# EAGLE design CubeSatBoard1 (EAGLE 8.4.1)
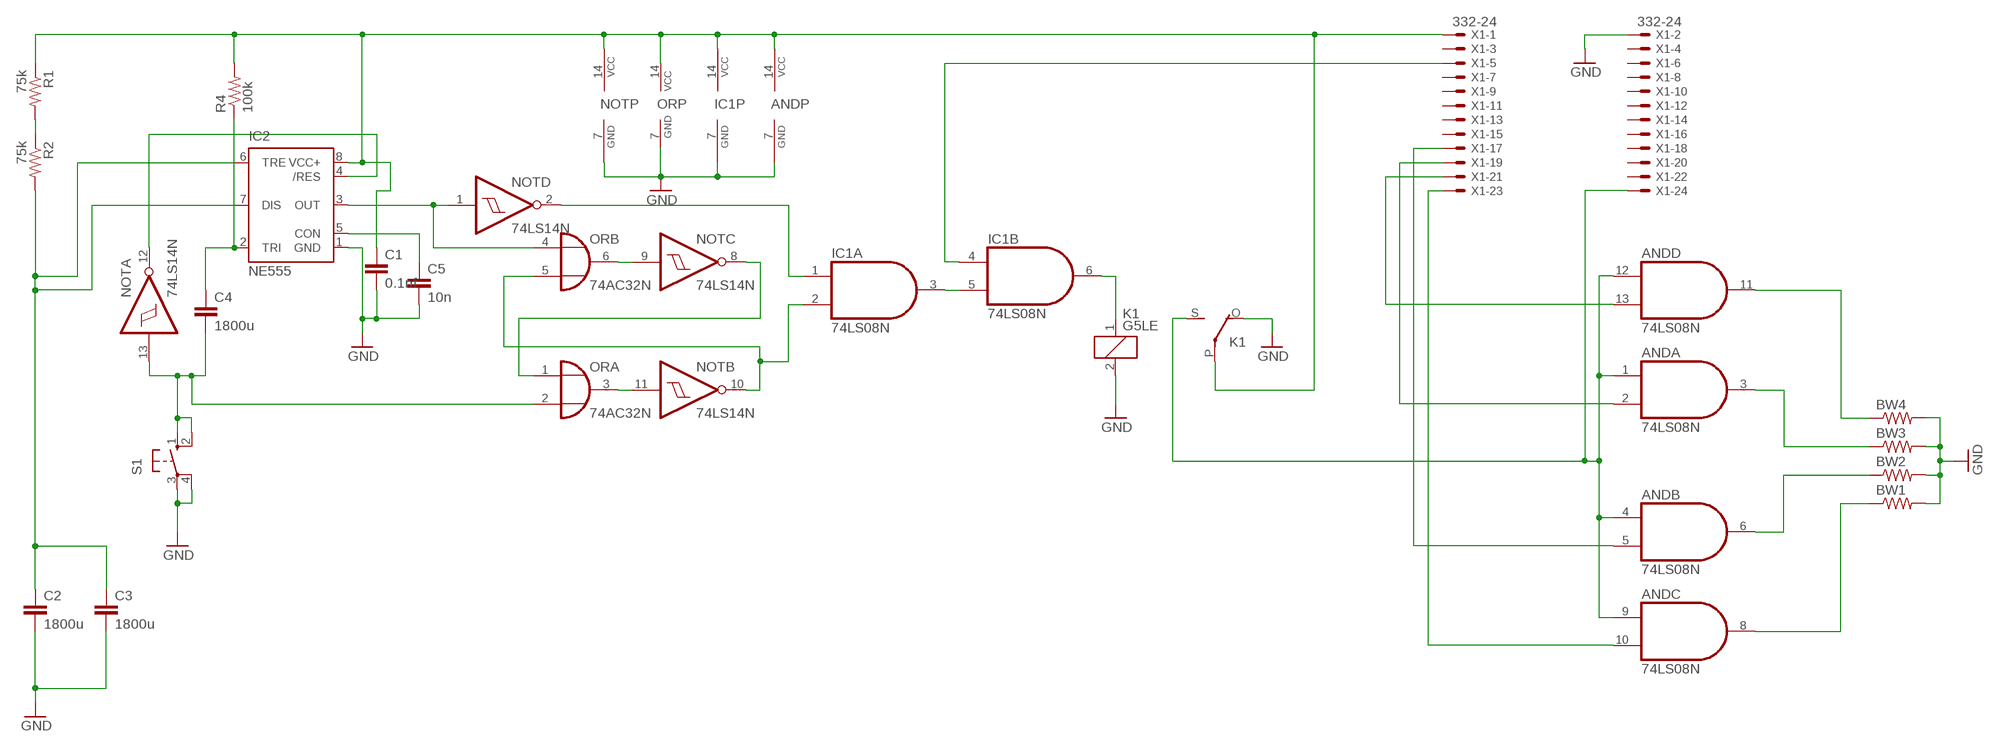
[diagram p0: schematic, sheet 1]

## Parts
AND  74LS08N  [DIL14]
BW1  R-US_0309/10  [0309/10]
BW2  R-US_0309/10  [0309/10]
BW3  R-US_0309/10  [0309/10]
BW4  R-US_0309/10  [0309/10]
C1  0.1nf  C5/3  [C5B3]
C2  1800u  C5/3  [C5B3]
C3  1800u  C5/3  [C5B3]
C4  1800u  C5/3  [C5B3]
C5  10n  C5/3  [C5B3]
IC1  74LS08N  [DIL14]
IC2  NE555  [DIL-08]
K1  G5LE  [G5LE]
NOT  74LS14N  [DIL14]
OR  74AC32N  [DIL14]
R1  75k  R-US_0309/10  [0309/10]
R2  75k  R-US_0309/10  [0309/10]
R4  100k  R-US_0309/10  [0309/10]
S1  10-XX  [B3F-10XX]
X1  332-24  [332-24]

## Nets
GND: AND.7(P:GND) BW1.2 BW2.2 BW3.2 BW4.2 C1.2 C2.2 C3.2 C5.2 IC1.7(P:GND) IC2.1(GND) K1.2 K1.O(2:O) NOT.7(P:GND) OR.7(P:GND) S1.3(P) S1.4(P1) X1.2
N$1: R1.2 R2.1
N$2: C2.1 C3.1 IC2.6(TRE) IC2.7(DIS) R2.2
N$3: AND.14(P:VCC) C1.1 IC1.14(P:VCC) IC2.8(VCC+) K1.P(2:P) NOT.14(P:VCC) OR.14(P:VCC) R1.1 R4.2 X1.1
N$4: NOT.9(C:I) OR.6(B:O)
N$5: IC2.4(/RES) NOT.12(A:O)
N$6: NOT.11(B:I) OR.3(A:O)
N$7: C4.2 NOT.13(A:I) OR.2(A:I1) S1.1(S) S1.2(S1)
N$8: C4.1 IC2.2(TRI) R4.1
N$9: IC2.3(OUT) NOT.1(D:I) OR.4(B:I0)
N$10: C5.1 IC2.5(CON)
N$11: AND.13(D:I1) X1.21
N$12: NOT.8(C:O) OR.1(A:I0)
N$13: IC1.2(A:I1) NOT.10(B:O) OR.5(B:I1)
N$14: IC1.1(A:I0) NOT.2(D:O)
N$15: IC1.3(A:O) IC1.5(B:I1)
N$16: AND.6(B:O) BW2.1
N$17: IC1.6(B:O) K1.1
N$18: AND.11(D:O) BW4.1
N$19: AND.3(A:O) BW3.1
N$20: AND.8(C:O) BW1.1
N$21: AND.1(A:I0) AND.4(B:I0) AND.9(C:I0) AND.12(D:I0) K1.S(2:S) X1.24
N$26: IC1.4(B:I0) X1.5
N$27: AND.2(A:I1) X1.19
N$28: AND.5(B:I1) X1.17
N$29: AND.10(C:I1) X1.23
Unconnected: IC1.8(C:O) IC1.9(C:I0) IC1.10(C:I1) IC1.11(D:O) IC1.12(D:I0) IC1.13(D:I1) NOT.3(E:I) NOT.4(E:O) NOT.5(F:I) NOT.6(F:O) OR.8(C:O) OR.9(C:I0) OR.10(C:I1) OR.11(D:O) OR.12(D:I0) OR.13(D:I1) X1.3 X1.4 X1.6 X1.7 X1.8 X1.9 X1.10 X1.11 X1.12 X1.13 X1.14 X1.15 X1.16 X1.18 X1.20 X1.22

## Library data of the parts
AND IC1 = 74xx-us:74*08: Quad 2-input AND gate
BW1-BW4 R1 R2 R4 = ECE2240+Project:R-US_: RESISTOR, American symbol
C1-C5 = ECE2240+Project:C: CAPACITOR naming: grid - package width
IC2 = st-microelectronics:NE555: General purpose bipolar Timer; MF: Arrow Electronics; MPN: NE555N; OC_FARNELL: 1467742; OC_NEWARK: 89K1486
K1 = relay:G5LE: RELAY 1 x switch, 10 A/120 V AC, 8 A/30 V DC, Omron; OC_FARNELL: unknown; OC_NEWARK: unknown
NOT = 74xx-us:74*14: Hex schmitt trigger INVERTER
OR = 74xx-eu:74*32: Quad 2-input OR gate
S1 = switch-omron:10-XX: OMRON SWITCH; MPN: B3F-1000; OC_FARNELL: 176432; OC_NEWARK: 36M3542
X1 = con-garry:332-24: 24 Pin - 2mm Dual Row Source: www.mpe-connector.de / garry_shortform_2012.pdf

## Board
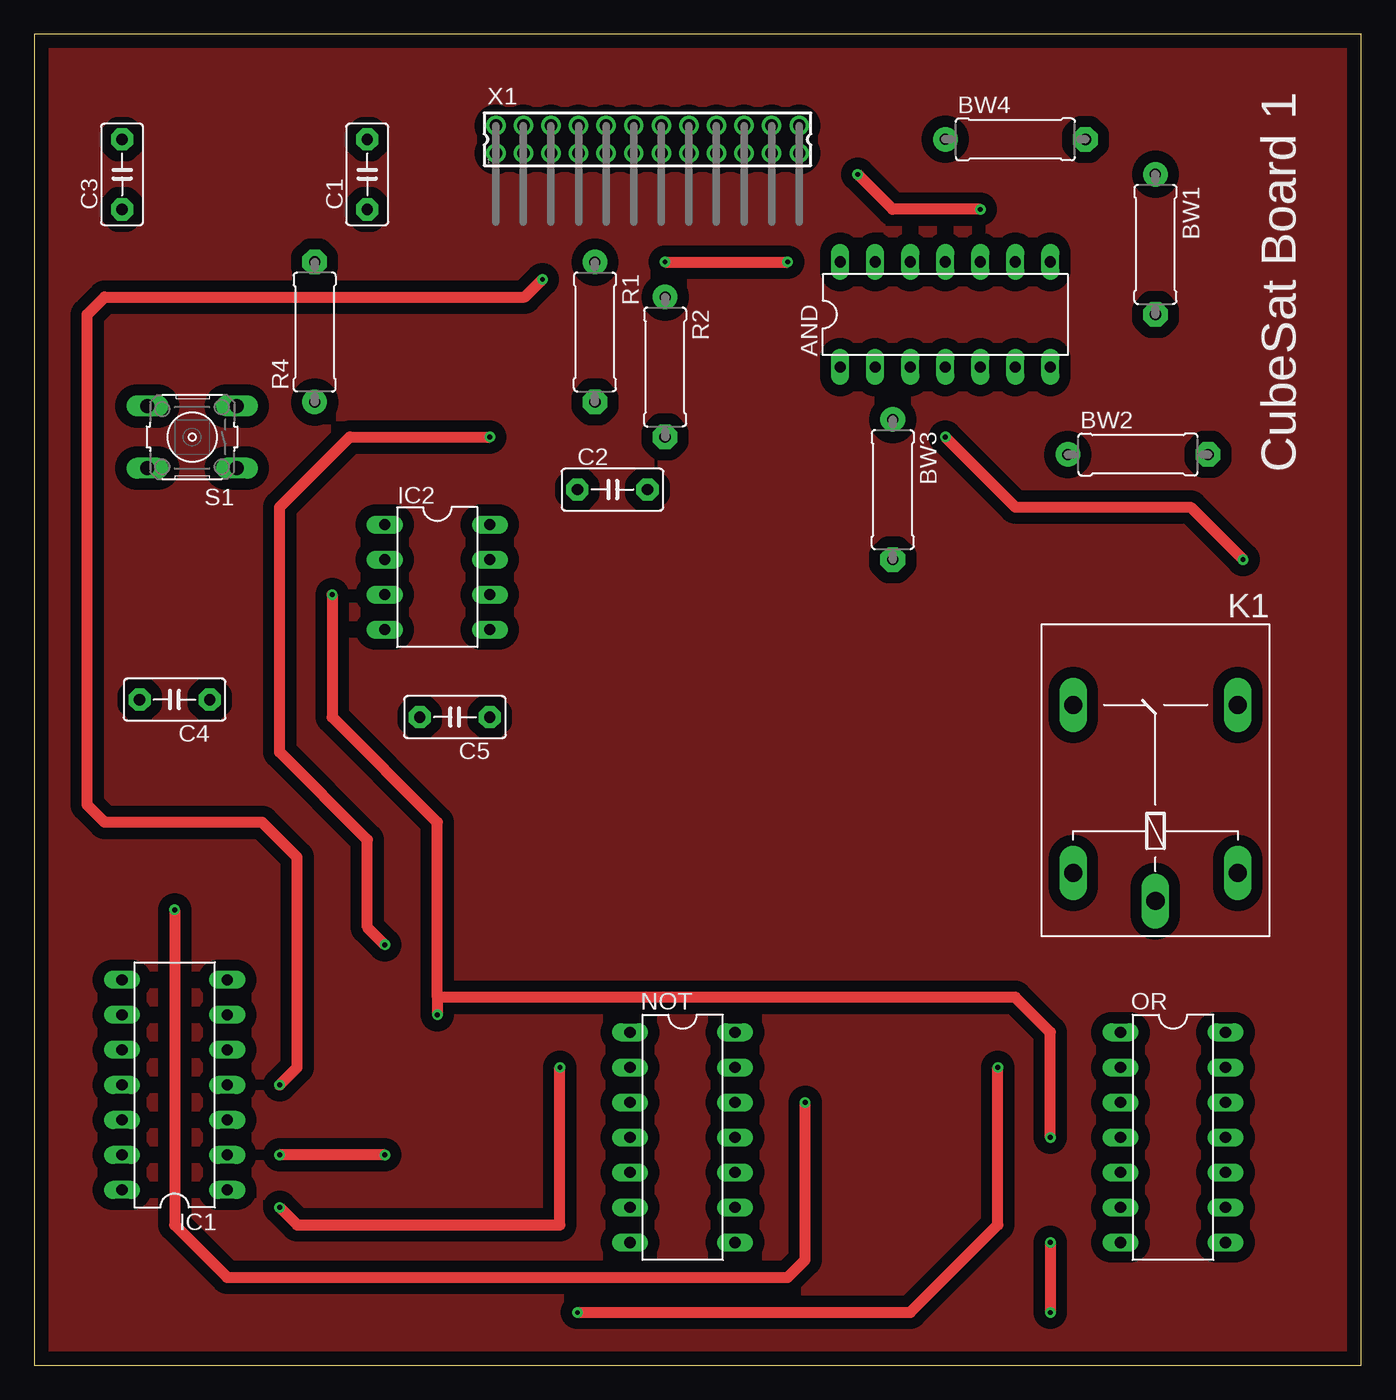
[diagram p1: board, top side]
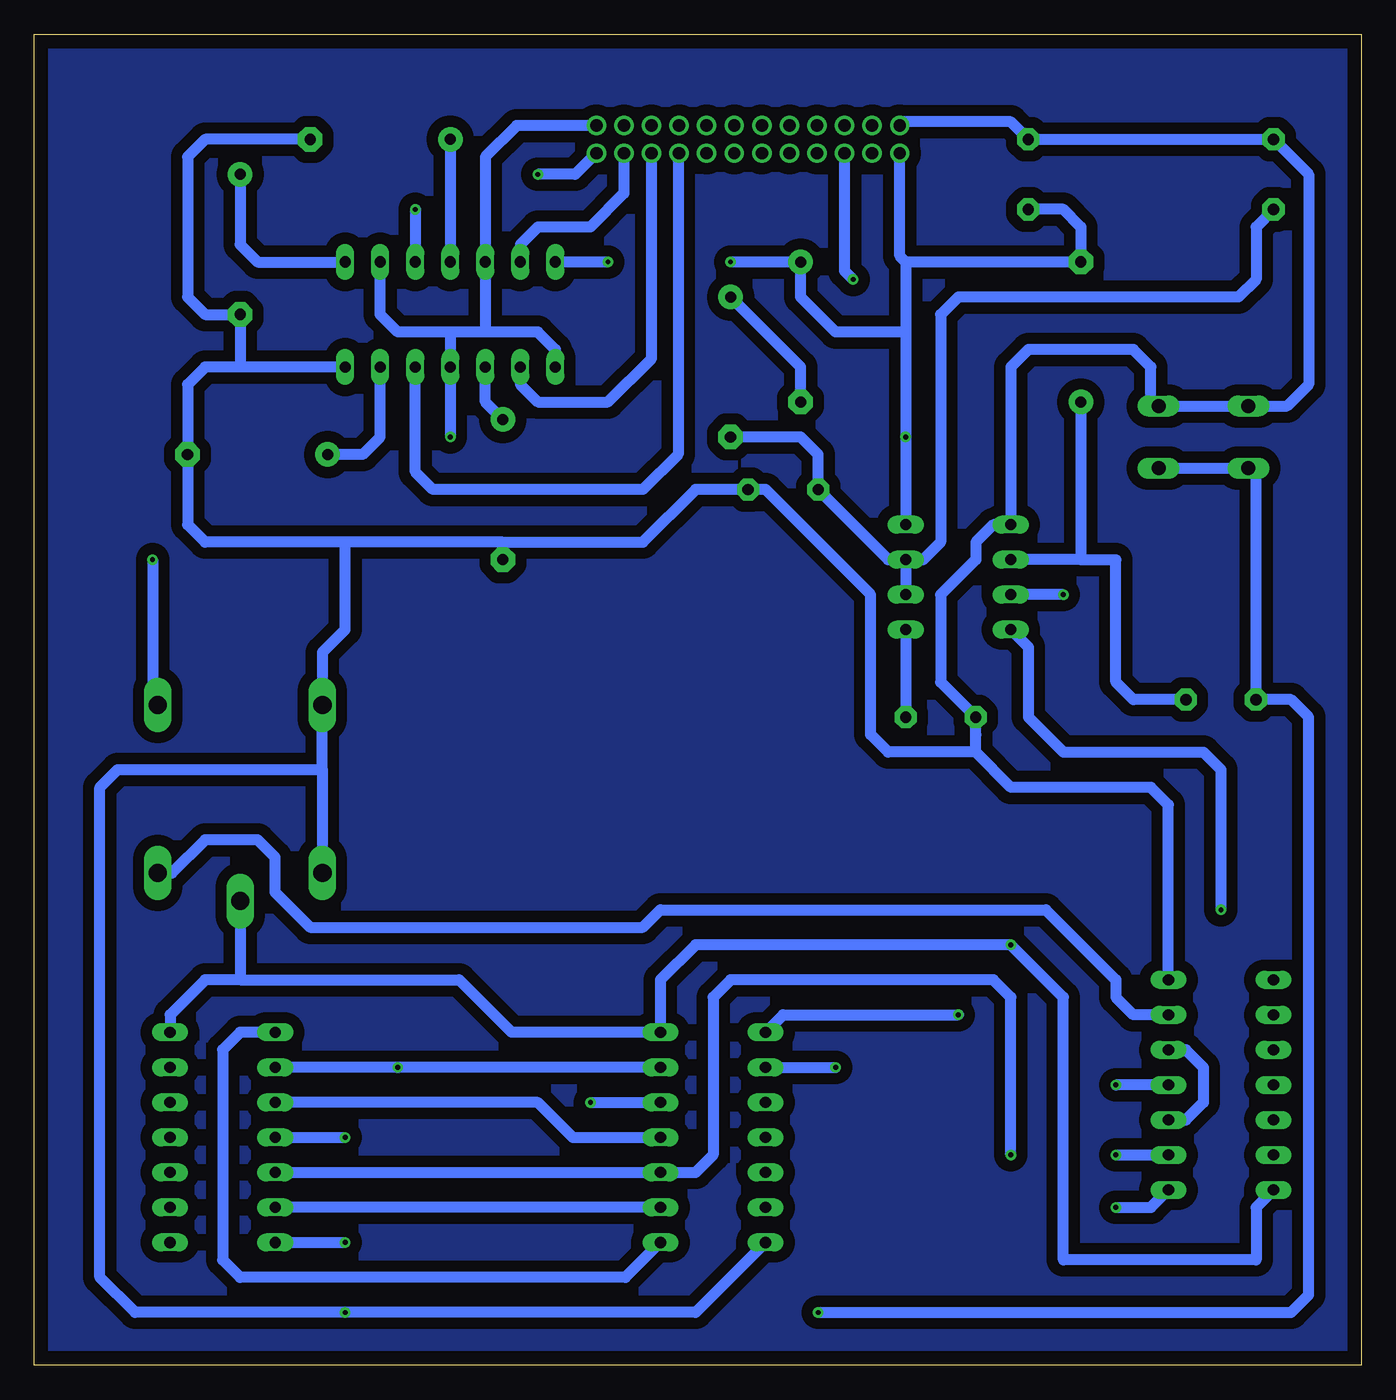
[diagram p2: board, bottom side, seen from below]

Size 96.19 x 96.51 mm. Coordinates in mm from the lower left corner, seen from the top.
Outline: 0,0 96.19,0 96.19,96.51 0,96.51 0,0
Copper layers (1*16): Top 0.035mm / dielectric 1.5mm / Bottom 0.035mm
Design rules "default": minimum track width 6mil, minimum drill 0.35mm, track to track 6mil, track to pad 6mil, pad to pad 6mil, via to via 6mil, smd to smd 6mil, copper to edge 40mil, drill to drill 6mil, minimum pad ring 10mil, minimum via ring 8mil, stop-mask expansion 4mil, vias tented up to drill 0mil, thermal gap 10mil

### Footprints (pad centres in the part's own frame; a part is rotated, then mirrored left to right if it is on the bottom)
DIL14 = drill 0.813 long: 1 -7.62,-3.81; 2 -5.08,-3.81; 3 -2.54,-3.81; 4 0,-3.81; 5 2.54,-3.81; 6 5.08,-3.81; 7 7.62,-3.81; 8 7.62,3.81; 9 5.08,3.81; 10 2.54,3.81; 11 0,3.81; 12 -2.54,3.81; 13 -5.08,3.81; 14 -7.62,3.81
0309/10 = drill 0.8 pad 1.778: 1 -5.08,0 | drill 0.813 pad 1.778 octagon: 2 5.08,0
C5B3 = drill 0.813 pad 1.6 octagon: 1 -2.54,0; 2 2.54,0
DIL-08 = drill 0.813 long: 1 -3.81,-3.81; 2 -1.27,-3.81; 3 1.27,-3.81; 4 3.81,-3.81; 5 3.81,3.81; 6 1.27,3.81; 7 -1.27,3.81; 8 -3.81,3.81
G5LE = drill 1.321 long: 1 -7.493,-5.969; 2 -7.493,5.969; O 4.699,5.969; P -9.525,0; S 4.699,-5.969
B3F-10XX = drill 1.016 long: 1 -3.251,2.261; 2 3.251,2.261; 3 -3.251,-2.261; 4 3.251,-2.261
332-24 = drill 0.9 pad 1.27: 1 -11,-1; 2 -11,1; 3 -9,-1; 4 -9,1; 5 -7,-1; 6 -7,1; 7 -5,-1; 8 -5,1; 9 -3,-1; 10 -3,1; 11 -1,-1; 12 -1,1; 13 1,-1; 14 1,1; 15 3,-1; 16 3,1; 17 5,-1; 18 5,1; 19 7,-1; 20 7,1; 21 9,-1; 22 9,1; 23 11,-1; 24 11,1

### Placement (x,y rotation side)
AND  66.04,76.2 0 top
BW1  81.28,81.28 270 top
BW2  80.01,66.04 0 top
BW3  62.23,63.5 270 top
BW4  71.12,88.9 0 top
C1  24.13,86.36 90 top
C2  41.91,63.5 0 top
C3  6.35,86.36 90 top
C4  10u  [C5B3]  10.16,48.26 180 top
C5  30.48,46.99 180 top
IC1  10.16,20.32 90 top
IC2  29.21,57.15 270 top
K1  81.28,43.18 90 top
NOT  46.99,16.51 270 top
OR  82.55,16.51 270 top
R1  40.64,74.93 270 top
R2  45.72,72.39 270 top
R4  20.32,74.93 90 top
S1  11.43,67.31 180 top
X1  44.45,88.9 0 top

### Tracks (layer width: path | path; a pad name or v marks a point on that pad's centre or on a via)
BOTTOM
  pour Bottom (isolate 0.813): 0,96.52 96.52,96.52 96.52,0 0,0
GND  (via drill 0.35)
  Top 0.813: v73.66,8.89 v73.66,3.81
  Bottom 0.813: 81.28,72.39 BW1.2 83.82,76.2 85.09,77.47 85.09,87.63 83.82,88.9 BW4.2 | AND.7 81.28,72.39 | X1.2 33.18,90.17 25.4,90.17 C1.2 C3.2 3.81,86.36 3.81,71.12 5.36,69.57 S1.4 S1.3 15.24,70.13 15.24,72.39 16.51,73.66 24.13,73.66 25.4,72.39 IC2.1 26.67,60.96 27.94,59.69 27.94,58.42 30.48,55.88 30.48,49.53 C5.2 | OR.7 v73.66,8.89 | NOT.7 48.26,3.81 v73.66,3.81 88.9,3.81 91.44,6.35 91.44,41.91 90.17,43.18 75.31,43.18 | 27.94,45.72 C5.2 | IC1.7 13.97,40.64 15.24,41.91 25.4,41.91 27.94,44.45 | 27.94,44.45 C5.2 | 62.23,59.69 73.66,59.69 | 62.23,59.69 52.07,59.69 48.26,63.5 C2.2 43.18,63.5 35.56,55.88 35.56,45.72 34.29,44.45 27.94,44.45 | 73.66,59.69 83.82,59.69 85.09,60.96 BW2.2 85.09,71.12 83.82,72.39 81.28,72.39 | 75.31,43.18 K1.O 75.31,51.69 73.66,53.34 73.66,59.69 | 75.31,43.18 K1.2 | BW3.2 62.23,59.69
N$1
  Bottom 0.813: R1.2 40.64,72.39 R2.1
N$2
  Bottom 0.813: IC2.7 31.75,58.42 30.48,59.69 30.48,76.2 29.21,77.47 8.89,77.47 7.62,78.74 7.62,82.55 C3.1 | IC2.7 IC2.6 | R2.2 40.64,67.31 39.37,66.04 C2.1 34.29,58.42 IC2.7
N$3  (via drill 0.35)
  Top 0.813: v45.72,80.01 v54.61,80.01 | v25.4,30.48 24.13,31.75 24.13,38.1 17.78,44.45 17.78,62.23 22.86,67.31 v33.02,67.31
  Bottom 0.813: v45.72,80.01 R1.1 40.64,77.47 38.1,74.93 33.02,74.93 | v54.61,80.01 AND.14 | 81.28,27.94 83.82,27.94 86.36,25.4 OR.14 | 81.28,27.94 65.41,27.94 61.59,24.13 NOT.14 50.8,27.94 48.26,30.48 v25.4,30.48 21.59,26.67 21.59,7.62 7.62,7.62 7.62,11.43 IC1.14 | C1.1 21.59,83.82 20.32,82.55 R4.2 33.02,80.01 | K1.P 81.28,27.94 | IC2.8 v33.02,67.31 33.02,74.93 | 33.02,80.01 33.02,74.93 | 33.02,80.01 33.45,80.44 X1.1
  other vias: 50.8,24.13
N$4
  Bottom 0.813: NOT.9 OR.6
N$5  (via drill 0.35)
  Top 0.813: v10.16,33.02 10.16,10.16 13.97,6.35 54.61,6.35 55.88,7.62 v55.88,19.05
  Bottom 0.813: IC2.4 24.13,52.07 24.13,46.99 21.59,44.45 11.43,44.45 10.16,43.18 v10.16,33.02 | v55.88,19.05 NOT.12
N$6
  Bottom 0.813: NOT.11 57.15,16.51 59.69,19.05 OR.3
N$7  (via drill 0.35)
  Top 0.813: v69.85,21.59 69.85,10.16 63.5,3.81 v39.37,3.81
  Bottom 0.813: NOT.13 v69.85,21.59 OR.2 | v39.37,3.81 5.08,3.81 3.81,5.08 3.81,46.99 5.08,48.26 C4.2 7.62,64.49 S1.2 S1.1
N$8
  Bottom 0.813: 20.32,58.42 17.78,58.42 17.78,49.53 16.51,48.26 C4.1 | 20.32,58.42 IC2.2 | R4.1 20.32,58.42
N$9  (via drill 0.35)
  Top 0.813: v21.59,55.88 21.59,46.99 29.21,39.37 29.21,26.67 | 29.21,26.67 v29.21,25.4 | v73.66,16.51 73.66,24.13 71.12,26.67 29.21,26.67
  Bottom 0.813: NOT.1 41.91,25.4 v29.21,25.4 | v21.59,55.88 IC2.3 | OR.4 v73.66,16.51
N$10
  Bottom 0.813: IC2.5 C5.1
N$11
  Bottom 0.813: X1.21 53.45,84.98 55.88,82.55 59.69,82.55 60.96,81.28 AND.13
N$12
  Bottom 0.813: NOT.8 53.34,6.35 81.28,6.35 82.55,7.62 82.55,22.86 81.28,24.13 OR.1
N$13  (via drill 0.35)
  Top 0.813: v25.4,15.24 v17.78,15.24
  Bottom 0.813: OR.5 NOT.10 48.26,13.97 46.99,15.24 46.99,26.67 45.72,27.94 26.67,27.94 25.4,26.67 v25.4,15.24 | v17.78,15.24 IC1.2
N$14  (via drill 0.35)
  Top 0.813: v17.78,11.43 19.05,10.16 38.1,10.16 v38.1,21.59
  Bottom 0.813: NOT.2 v38.1,21.59 | v17.78,11.43 15.24,11.43 IC1.1
N$15
  Bottom 0.813: IC1.5 12.7,22.86 11.43,21.59 11.43,19.05 12.7,17.78 IC1.3
N$16
  Bottom 0.813: BW2.1 72.39,66.04 71.12,67.31 AND.6
N$17
  Bottom 0.813: IC1.6 16.51,25.4 17.78,26.67 17.78,27.94 22.86,33.02 50.8,33.02 52.07,31.75 76.2,31.75 78.74,34.29 78.74,36.83 80.01,38.1 83.82,38.1 86.23,35.69 K1.1
N$18
  Bottom 0.813: BW4.1 AND.11
N$19
  Bottom 0.813: BW3.1 63.5,69.85 AND.3
N$20
  Bottom 0.813: BW1.1 81.28,81.28 80.01,80.01 AND.8
N$21  (via drill 0.35)
  Top 0.813: v66.04,67.31 71.12,62.23 83.82,62.23 v87.63,58.42
  Bottom 0.813: AND.1 58.42,73.66 59.69,74.93 63.5,74.93 | 63.5,74.93 66.04,74.93 | 66.04,74.93 69.85,74.93 71.12,76.2 AND.9 | 66.04,74.93 AND.4 v66.04,67.31 | 63.5,74.93 AND.12 63.5,87.63 61.23,89.9 X1.24 | K1.S 87.63,48.26 v87.63,58.42
N$26  (via drill 0.35)
  Top 0.813: v17.78,20.32 19.05,21.59 19.05,36.83 16.51,39.37 5.08,39.37 3.81,40.64 3.81,76.2 5.08,77.47 35.56,77.47 v36.83,78.74
  Bottom 0.813: IC1.4 v17.78,20.32 | v36.83,78.74 37.45,79.36 X1.5
N$27
  Bottom 0.813: AND.2 60.96,71.12 59.69,69.85 54.61,69.85 51.45,73.01 X1.19
N$28
  Bottom 0.813: X1.17 49.53,87.82 49.53,66.04 52.07,63.5 67.31,63.5 68.58,64.77 AND.5
N$29  (via drill 0.35)
  Top 0.813: v68.58,83.82 62.23,83.82 v59.69,86.36
  Bottom 0.813: X1.23 56.99,86.36 v59.69,86.36 | v68.58,83.82 AND.10
TOP
  pour Top (isolate 0.813): 0,96.52 96.52,96.52 96.52,0 0,0

### Text on the board
tPlace: CubeSat Board 1